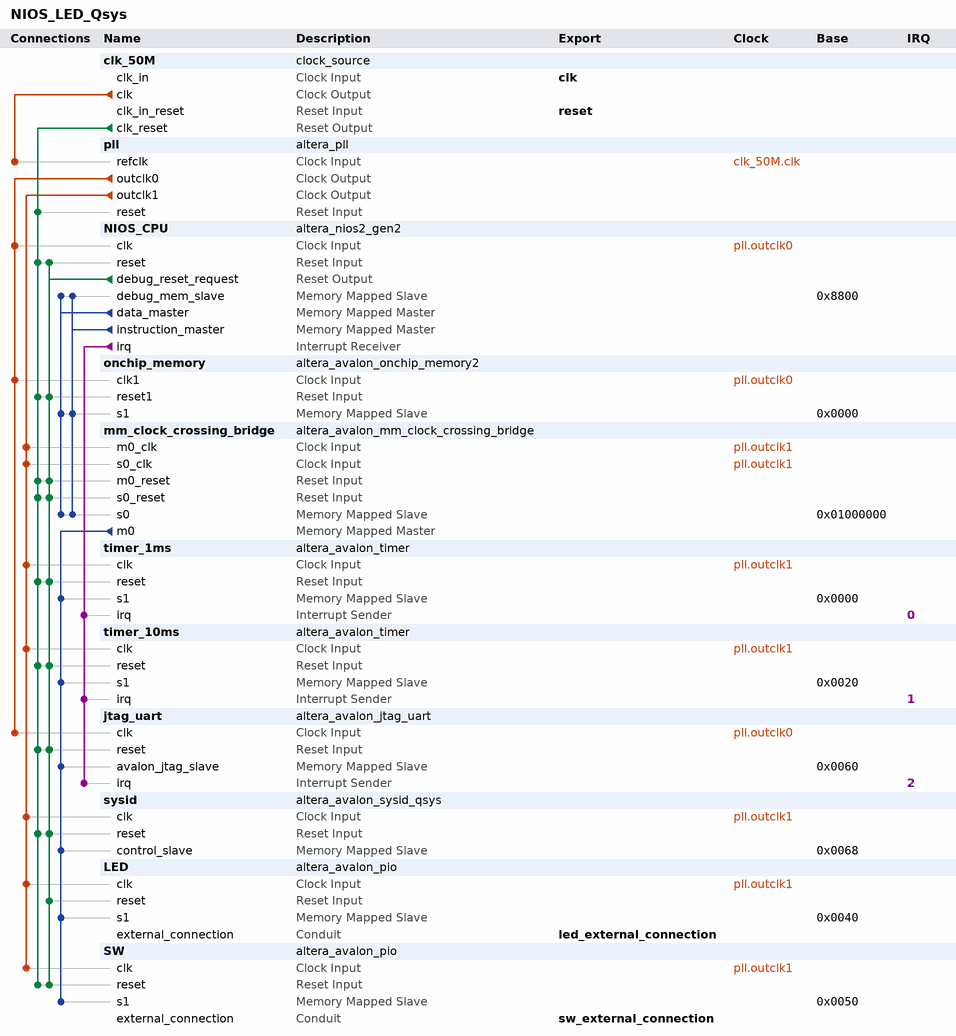
[diagram p0: system contents]
# Platform Designer (Qsys) system NIOS_LED_Qsys, Cyclone V 5CSXFC6D6F31C6
# Parameters at their usual value, and those the tool derives, are not listed.
package require -exact qsys 18.1
create_system NIOS_LED_Qsys
set_project_property DEVICE_FAMILY {Cyclone V}
set_project_property DEVICE 5CSXFC6D6F31C6

add_instance clk_50M clock_source 18.1
set_instance_parameter_value clk_50M clockFrequency 50000000

add_instance pll altera_pll 18.1
set_instance_parameter_value pll gui_device_speed_grade 1
set_instance_parameter_value pll gui_number_of_clocks 2
set_instance_parameter_value pll gui_operation_mode direct
set_instance_parameter_value pll gui_output_clock_frequency0 100.0
set_instance_parameter_value pll gui_output_clock_frequency1 40.0
set_instance_parameter_value pll gui_pll_mode {Integer-N PLL}
set_instance_parameter_value pll gui_reference_clock_frequency 50.0
set_instance_parameter_value pll gui_use_locked false

add_instance NIOS_CPU altera_nios2_gen2 18.1
set_instance_parameter_value NIOS_CPU dcache_size 2048
set_instance_parameter_value NIOS_CPU exceptionSlave onchip_memory.s1
set_instance_parameter_value NIOS_CPU icache_size 4096
set_instance_parameter_value NIOS_CPU impl Tiny
set_instance_parameter_value NIOS_CPU resetSlave onchip_memory.s1

add_instance onchip_memory altera_avalon_onchip_memory2 18.1
set_instance_parameter_value onchip_memory dataWidth 32
set_instance_parameter_value onchip_memory dualPort false
set_instance_parameter_value onchip_memory initMemContent true
set_instance_parameter_value onchip_memory initializationFileName onchip_mem.hex
set_instance_parameter_value onchip_memory memorySize 32768

add_instance mm_clock_crossing_bridge altera_avalon_mm_clock_crossing_bridge 18.1
set_instance_parameter_value mm_clock_crossing_bridge ADDRESS_UNITS WORDS
set_instance_parameter_value mm_clock_crossing_bridge ADDRESS_WIDTH 10
set_instance_parameter_value mm_clock_crossing_bridge COMMAND_FIFO_DEPTH 32
set_instance_parameter_value mm_clock_crossing_bridge DATA_WIDTH 32
set_instance_parameter_value mm_clock_crossing_bridge MASTER_SYNC_DEPTH 3
set_instance_parameter_value mm_clock_crossing_bridge MAX_BURST_SIZE 1
set_instance_parameter_value mm_clock_crossing_bridge RESPONSE_FIFO_DEPTH 8
set_instance_parameter_value mm_clock_crossing_bridge SLAVE_SYNC_DEPTH 3
set_instance_parameter_value mm_clock_crossing_bridge USE_AUTO_ADDRESS_WIDTH 0

add_instance timer_1ms altera_avalon_timer 18.1
set_instance_parameter_value timer_1ms period 1
set_instance_parameter_value timer_1ms periodUnits MSEC

add_instance timer_10ms altera_avalon_timer 18.1
set_instance_parameter_value timer_10ms period 10
set_instance_parameter_value timer_10ms periodUnits MSEC

add_instance jtag_uart altera_avalon_jtag_uart 18.1
set_instance_parameter_value jtag_uart simInteractiveOptions NO_INTERACTIVE_WINDOWS

add_instance sysid altera_avalon_sysid_qsys 18.1
set_instance_parameter_value sysid id 0

add_instance LED altera_avalon_pio 18.1
set_instance_parameter_value LED direction Output
set_instance_parameter_value LED width 8

add_instance SW altera_avalon_pio 18.1
set_instance_parameter_value SW direction Input
set_instance_parameter_value SW width 1

# connections
add_connection clk_50M.clk pll.refclk clock
add_connection pll.outclk0 jtag_uart.clk clock
add_connection pll.outclk0 NIOS_CPU.clk clock
add_connection pll.outclk0 onchip_memory.clk1 clock
add_connection pll.outclk1 LED.clk clock
add_connection pll.outclk1 mm_clock_crossing_bridge.m0_clk clock
add_connection pll.outclk1 mm_clock_crossing_bridge.s0_clk clock
add_connection pll.outclk1 SW.clk clock
add_connection pll.outclk1 sysid.clk clock
add_connection pll.outclk1 timer_1ms.clk clock
add_connection pll.outclk1 timer_10ms.clk clock
add_connection clk_50M.clk_reset jtag_uart.reset reset
add_connection clk_50M.clk_reset mm_clock_crossing_bridge.m0_reset reset
add_connection clk_50M.clk_reset mm_clock_crossing_bridge.s0_reset reset
add_connection clk_50M.clk_reset NIOS_CPU.reset reset
add_connection clk_50M.clk_reset onchip_memory.reset1 reset
add_connection clk_50M.clk_reset pll.reset reset
add_connection clk_50M.clk_reset SW.reset reset
add_connection clk_50M.clk_reset sysid.reset reset
add_connection clk_50M.clk_reset timer_1ms.reset reset
add_connection clk_50M.clk_reset timer_10ms.reset reset
add_connection NIOS_CPU.debug_reset_request jtag_uart.reset reset
add_connection NIOS_CPU.debug_reset_request LED.reset reset
add_connection NIOS_CPU.debug_reset_request mm_clock_crossing_bridge.m0_reset reset
add_connection NIOS_CPU.debug_reset_request mm_clock_crossing_bridge.s0_reset reset
add_connection NIOS_CPU.debug_reset_request NIOS_CPU.reset reset
add_connection NIOS_CPU.debug_reset_request onchip_memory.reset1 reset
add_connection NIOS_CPU.debug_reset_request SW.reset reset
add_connection NIOS_CPU.debug_reset_request sysid.reset reset
add_connection NIOS_CPU.debug_reset_request timer_1ms.reset reset
add_connection NIOS_CPU.debug_reset_request timer_10ms.reset reset
add_connection mm_clock_crossing_bridge.m0 jtag_uart.avalon_jtag_slave avalon
set_connection_parameter_value mm_clock_crossing_bridge.m0/jtag_uart.avalon_jtag_slave baseAddress 0x0060
add_connection mm_clock_crossing_bridge.m0 LED.s1 avalon
set_connection_parameter_value mm_clock_crossing_bridge.m0/LED.s1 baseAddress 0x0040
add_connection mm_clock_crossing_bridge.m0 SW.s1 avalon
set_connection_parameter_value mm_clock_crossing_bridge.m0/SW.s1 baseAddress 0x0050
add_connection mm_clock_crossing_bridge.m0 sysid.control_slave avalon
set_connection_parameter_value mm_clock_crossing_bridge.m0/sysid.control_slave baseAddress 0x0068
add_connection mm_clock_crossing_bridge.m0 timer_1ms.s1 avalon
set_connection_parameter_value mm_clock_crossing_bridge.m0/timer_1ms.s1 baseAddress 0x0000
add_connection mm_clock_crossing_bridge.m0 timer_10ms.s1 avalon
set_connection_parameter_value mm_clock_crossing_bridge.m0/timer_10ms.s1 baseAddress 0x0020
add_connection NIOS_CPU.data_master mm_clock_crossing_bridge.s0 avalon
set_connection_parameter_value NIOS_CPU.data_master/mm_clock_crossing_bridge.s0 baseAddress 0x01000000
add_connection NIOS_CPU.data_master NIOS_CPU.debug_mem_slave avalon
set_connection_parameter_value NIOS_CPU.data_master/NIOS_CPU.debug_mem_slave baseAddress 0x8800
add_connection NIOS_CPU.data_master onchip_memory.s1 avalon
set_connection_parameter_value NIOS_CPU.data_master/onchip_memory.s1 baseAddress 0x0000
add_connection NIOS_CPU.instruction_master mm_clock_crossing_bridge.s0 avalon
set_connection_parameter_value NIOS_CPU.instruction_master/mm_clock_crossing_bridge.s0 baseAddress 0x01000000
add_connection NIOS_CPU.instruction_master NIOS_CPU.debug_mem_slave avalon
set_connection_parameter_value NIOS_CPU.instruction_master/NIOS_CPU.debug_mem_slave baseAddress 0x8800
add_connection NIOS_CPU.instruction_master onchip_memory.s1 avalon
set_connection_parameter_value NIOS_CPU.instruction_master/onchip_memory.s1 baseAddress 0x0000
add_connection NIOS_CPU.irq jtag_uart.irq interrupt
set_connection_parameter_value NIOS_CPU.irq/jtag_uart.irq irqNumber 2
add_connection NIOS_CPU.irq timer_1ms.irq interrupt
set_connection_parameter_value NIOS_CPU.irq/timer_1ms.irq irqNumber 0
add_connection NIOS_CPU.irq timer_10ms.irq interrupt
set_connection_parameter_value NIOS_CPU.irq/timer_10ms.irq irqNumber 1

# exported interfaces
add_interface clk clock sink
set_interface_property clk EXPORT_OF clk_50M.clk_in
add_interface led_external_connection conduit end
set_interface_property led_external_connection EXPORT_OF LED.external_connection
add_interface reset reset sink
set_interface_property reset EXPORT_OF clk_50M.clk_in_reset
add_interface sw_external_connection conduit end
set_interface_property sw_external_connection EXPORT_OF SW.external_connection

set_interconnect_requirement {$system} qsys_mm.clockCrossingAdapter HANDSHAKE
set_interconnect_requirement {$system} qsys_mm.enableEccProtection FALSE
set_interconnect_requirement {$system} qsys_mm.insertDefaultSlave FALSE
set_interconnect_requirement {$system} qsys_mm.maxAdditionalLatency 1

save_system NIOS_LED_Qsys.qsys
